# EAGLE schematic PLACA Mina (EAGLE 6.6.0)
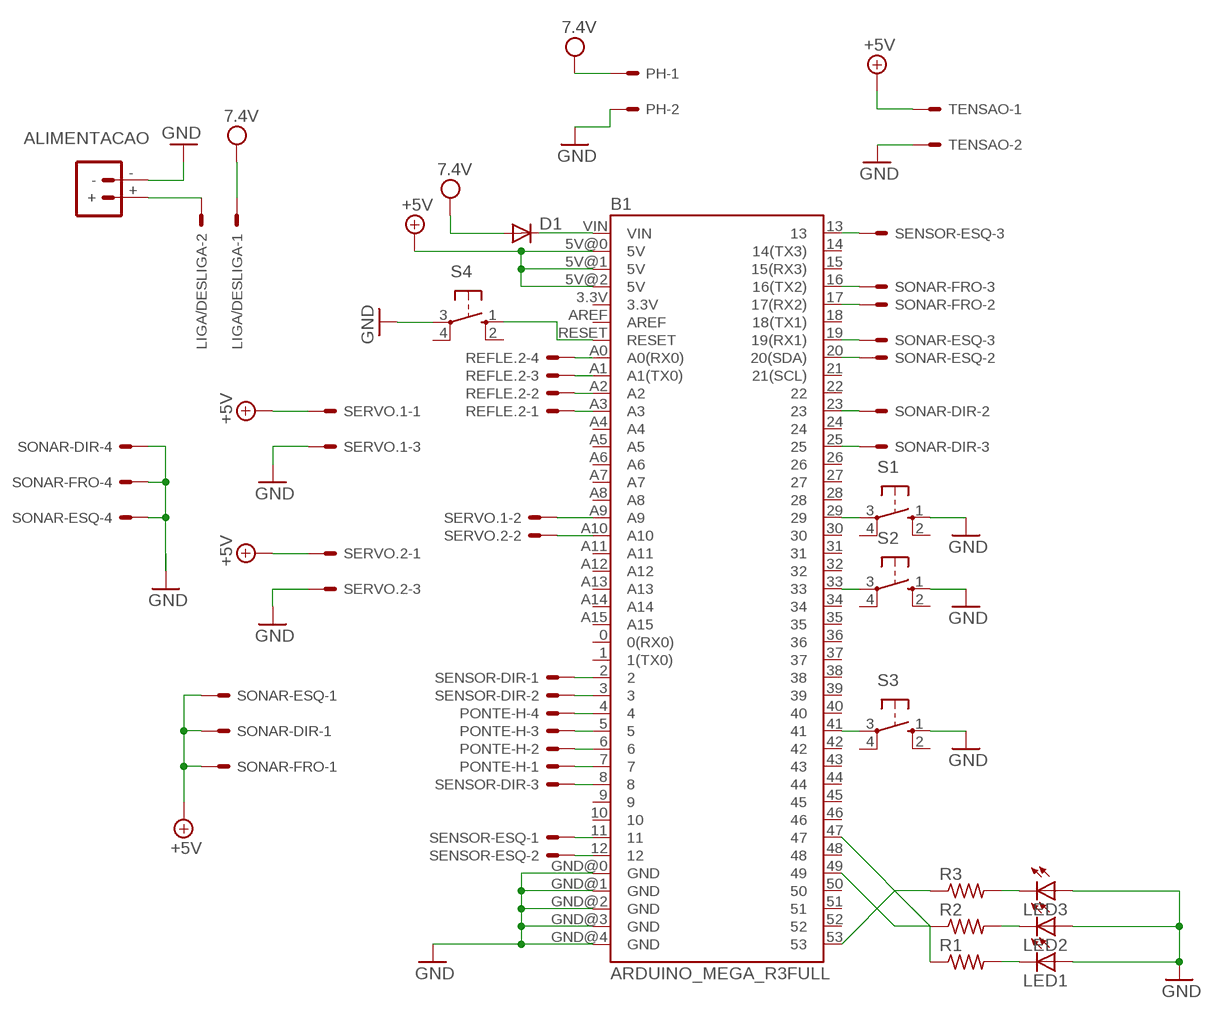
[diagram p0: schematic, sheet 1]

## Parts
ALIMENTACAO  BATTERY_CONNXT60  [XT60]
B1  ARDUINO_MEGA_R3FULL  [ARDUINO_MEGA]
D1  1N4004  [DO41-10]
LED1  LED5MM  [LED5MM]
LED2  LED5MM  [LED5MM]
LED3  LED5MM  [LED5MM]
LIGA/DESLIGA  CONN_0227-2021  [6410-02]
PH  CONN_0227-2021  [6410-02]
PONTE-H  CONN_0427-2041  [6410-04]
R1  R-US_0204/7  [0204/7]
R2  R-US_0204/7  [0204/7]
R3  R-US_0204/7  [0204/7]
REFLE.2  CONN_0427-2041  [6410-04]
S1  10-XX  [B3F-10XX]
S2  10-XX  [B3F-10XX]
S3  10-XX  [B3F-10XX]
S4  10-XX  [B3F-10XX]
SENSOR-DIR  CONN_0327-2031  [6410-03]
SENSOR-ESQ  CONN_0327-2031  [6410-03]
SERVO.1  CONN_0327-2031  [6410-03]
SERVO.2  CONN_0327-2031  [6410-03]
SONAR-DIR  CONN_0427-2041  [6410-04]
SONAR-ESQ  CONN_0427-2041  [6410-04]
SONAR-FRO  CONN_0427-2041  [6410-04]
TENSAO  CONN_0227-2021  [6410-02]

## Nets
+5V: B1.5V@0(5V) B1.5V@1(5V) B1.5V@2(5V) SERVO.1.1 SERVO.2.1 SONAR-DIR.1 SONAR-ESQ.1 SONAR-FRO.1 TENSAO.1
GND: ALIMENTACAO.- B1.GND@0(GND) B1.GND@1(GND) B1.GND@2(GND) B1.GND@3(GND) B1.GND@4(GND) LED1.A LED2.A LED3.A PH.2 S1.1(S) S2.1(S) S3.1(S) S4.3(P) SERVO.1.3 SERVO.2.3 SONAR-DIR.4 SONAR-ESQ.4 SONAR-FRO.4 TENSAO.2
N$1: B1.A3 REFLE.2.1
N$2: B1.A2 REFLE.2.2
N$3: B1.A1(A1(TX0)) REFLE.2.3
N$4: B1.A0(A0(RX0)) REFLE.2.4
N$5: B1.16(16(TX2)) SONAR-FRO.3
N$6: B1.17(17(RX2)) SONAR-FRO.2
N$7: B1.7 PONTE-H.1
N$8: B1.6 PONTE-H.2
N$9: B1.5 PONTE-H.3
N$10: B1.4 PONTE-H.4
N$11: B1.20(20(SDA)) SONAR-ESQ.2
N$12: B1.19(19(RX1)) SONAR-ESQ.3
N$13: B1.23 SONAR-DIR.2
N$14: B1.25 SONAR-DIR.3
N$15: B1.11 SENSOR-ESQ.1
N$16: B1.12 SENSOR-ESQ.2
N$17: B1.13 SENSOR-ESQ.3
N$18: B1.2 SENSOR-DIR.1
N$19: B1.3 SENSOR-DIR.2
N$20: B1.8 SENSOR-DIR.3
N$21: B1.A10 SERVO.2.2
N$22: B1.A9 SERVO.1.2
N$23: B1.29 S1.3(P)
N$24: B1.33 S2.3(P)
N$25: B1.41 S3.3(P)
N$26: B1.53 R3.1
N$27: B1.49 R2.1
N$28: B1.47 R1.1
N$29: LED1.K(C) R1.2
N$30: LED2.K(C) R2.2
N$31: LED3.K(C) R3.2
N$32: B1.VIN D1.C
N$33: ALIMENTACAO.+ LIGA/DESLIGA.2
N$34: B1.RESET S4.1(S)
VDD: D1.A LIGA/DESLIGA.1 PH.1 ; supply symbol labelled 7.4V
Unconnected: B1.0(0(RX0)) B1.1(1(TX0)) B1.3.3V B1.9 B1.10 B1.14(14(TX3)) B1.15(15(RX3)) B1.18(18(TX1)) B1.21(21(SCL)) B1.22 B1.24 B1.26 B1.27 B1.28 B1.30 B1.31 B1.32 B1.34 B1.35 B1.36 B1.37 B1.38 B1.39 B1.40 B1.42 B1.43 B1.44 B1.45 B1.46 B1.48 B1.50 B1.51 B1.52 B1.A4 B1.A5 B1.A6 B1.A7 B1.A8 B1.A11 B1.A12 B1.A13 B1.A14 B1.A15 B1.AREF S1.2(S1) S1.4(P1) S2.2(S1) S2.4(P1) S3.2(S1) S3.4(P1) S4.2(S1) S4.4(P1)

## Library data of the parts
ALIMENTACAO = Robotica-IFRN-SC-conectores:BATTERY_CONN: Battery Connectors Various footprints for battery connections
B1 = Robotica-IFRN-SC-Arduino:ARDUINO_MEGA_R3: Arduino Mega R3 ATmega2560 R3 compatible footprint. SparkFun Products: Arduino Mega 2560 R3 <https://www.sparkfun.com/products/11061>
D1 = diode:1N4004: DIODE general purpose rectifier, 1 A
LED1-LED3 = led:LED: LED OSRAM: - CHIPLED LG R971, LG N971, LY N971, LG Q971, LY Q971, LO R971, LY R971 LH N974, LH R974 LS Q976, LO Q976, LY Q976 LO Q996 - Hyper CHIPLED LW Q18S LB Q993, LB Q99A, LB R99A - SideLED LS A670, LO A670, LY A670, LG A670, LP A670 LB A673, LV A673, LT A673, LW A673 LH A674 LY A675 LS A676, LA A676, LO A676, LY A676, LW A676 LS A679, LY A679, LG A679 - Hyper Micro SIDELED® LS Y876, LA Y876, LO Y876, LY Y876 LT Y87S - SmartLED LW L88C, LW L88S LB L89C, LB L89S, LG L890 LS L89K, LO L89K, LY L89K LS L896, LA L896, LO L896, LY L896 - TOPLED LS T670, LO T670, LY T670, LG T670, LP T670 LSG T670, LSP T670, LSY T670, LOP T670, LYG T670 LG T671, LOG T671, LSG T671 LB T673, LV T673, LT T673, LW T673 LH T674 LS T676, LA T676, LO T676, LY T676, LB T676, LH T676, LSB T676, LW T676 LB T67C, LV T67C, LT T67C, LS T67K, LO T67K, LY T67K, LW E67C LS E67B, LA E67B, LO E67B, LY E67B, LB E67C, LV E67C, LT E67C LW T67C LS T679, LY T679, LG T679 LS T770, LO T770, LY T770, LG T770, LP T770 LB T773, LV T773, LT T773, LW T773 LH T774 LS E675, LA E675, LY E675, LS T675 LS T776, LA T776, LO T776, LY T776, LB T776 LHGB T686 LT T68C, LB T68C - Hyper Mini TOPLED® LB M676 - Mini TOPLED Santana® LG M470 LS M47K, LO M47K, LY M47K Source: http://www.osram.convergy.de LUXEON: - LUMILED® LXK2-PW12-R00, LXK2-PW12-S00, LXK2-PW14-U00, LXK2-PW14-V00 LXK2-PM12-R00, LXK2-PM12-S00, LXK2-PM14-U00 LXK2-PE12-Q00, LXK2-PE12-R00, LXK2-PE12-S00, LXK2-PE14-T00, LXK2-PE14-U00 LXK2-PB12-K00, LXK2-PB12-L00, LXK2-PB12-M00, LXK2-PB14-N00, LXK2-PB14-P00, LXK2-PB14-Q00 LXK2-PR12-L00, LXK2-PR12-M00, LXK2-PR14-Q00, LXK2-PR14-R00 LXK2-PD12-Q00, LXK2-PD12-R00, LXK2-PD12-S00 LXK2-PH12-R00, LXK2-PH12-S00 LXK2-PL12-P00, LXK2-PL12-Q00, LXK2-PL12-R00 Source: www.luxeon.com KINGBRIGHT: KA-3528ASYC Source: www.kingbright.com
LIGA/DESLIGA PH TENSAO = Robotica-IFRN-SC-conectores:CONN_02: CONNECTOR wire to board 2.54 mm (.1 inch) pitch header; OC_FARNELL: unknown; OC_NEWARK: unknown
PONTE-H REFLE.2 SONAR-DIR SONAR-ESQ SONAR-FRO = Robotica-IFRN-SC-conectores:CONN_04: CONNECTOR wire to board 2.54 mm (.1 inch) pitch header; OC_FARNELL: unknown; OC_NEWARK: unknown
R1-R3 = rcl:R-US_: RESISTOR, American symbol
S1-S4 = switch-omron:10-XX: OMRON SWITCH; MPN: B3F-1000; OC_FARNELL: 176432; OC_NEWARK: 36M3542
SENSOR-DIR SENSOR-ESQ SERVO.1 SERVO.2 = Robotica-IFRN-SC-conectores:CONN_03: CONNECTOR wire to board 2.54 mm (.1 inch) pitch header; OC_FARNELL: unknown; OC_NEWARK: unknown